# EAGLE design Sensor_Board_v2.4.1.2.N (EAGLE 9.4.0)

## Sheet 1 of 2
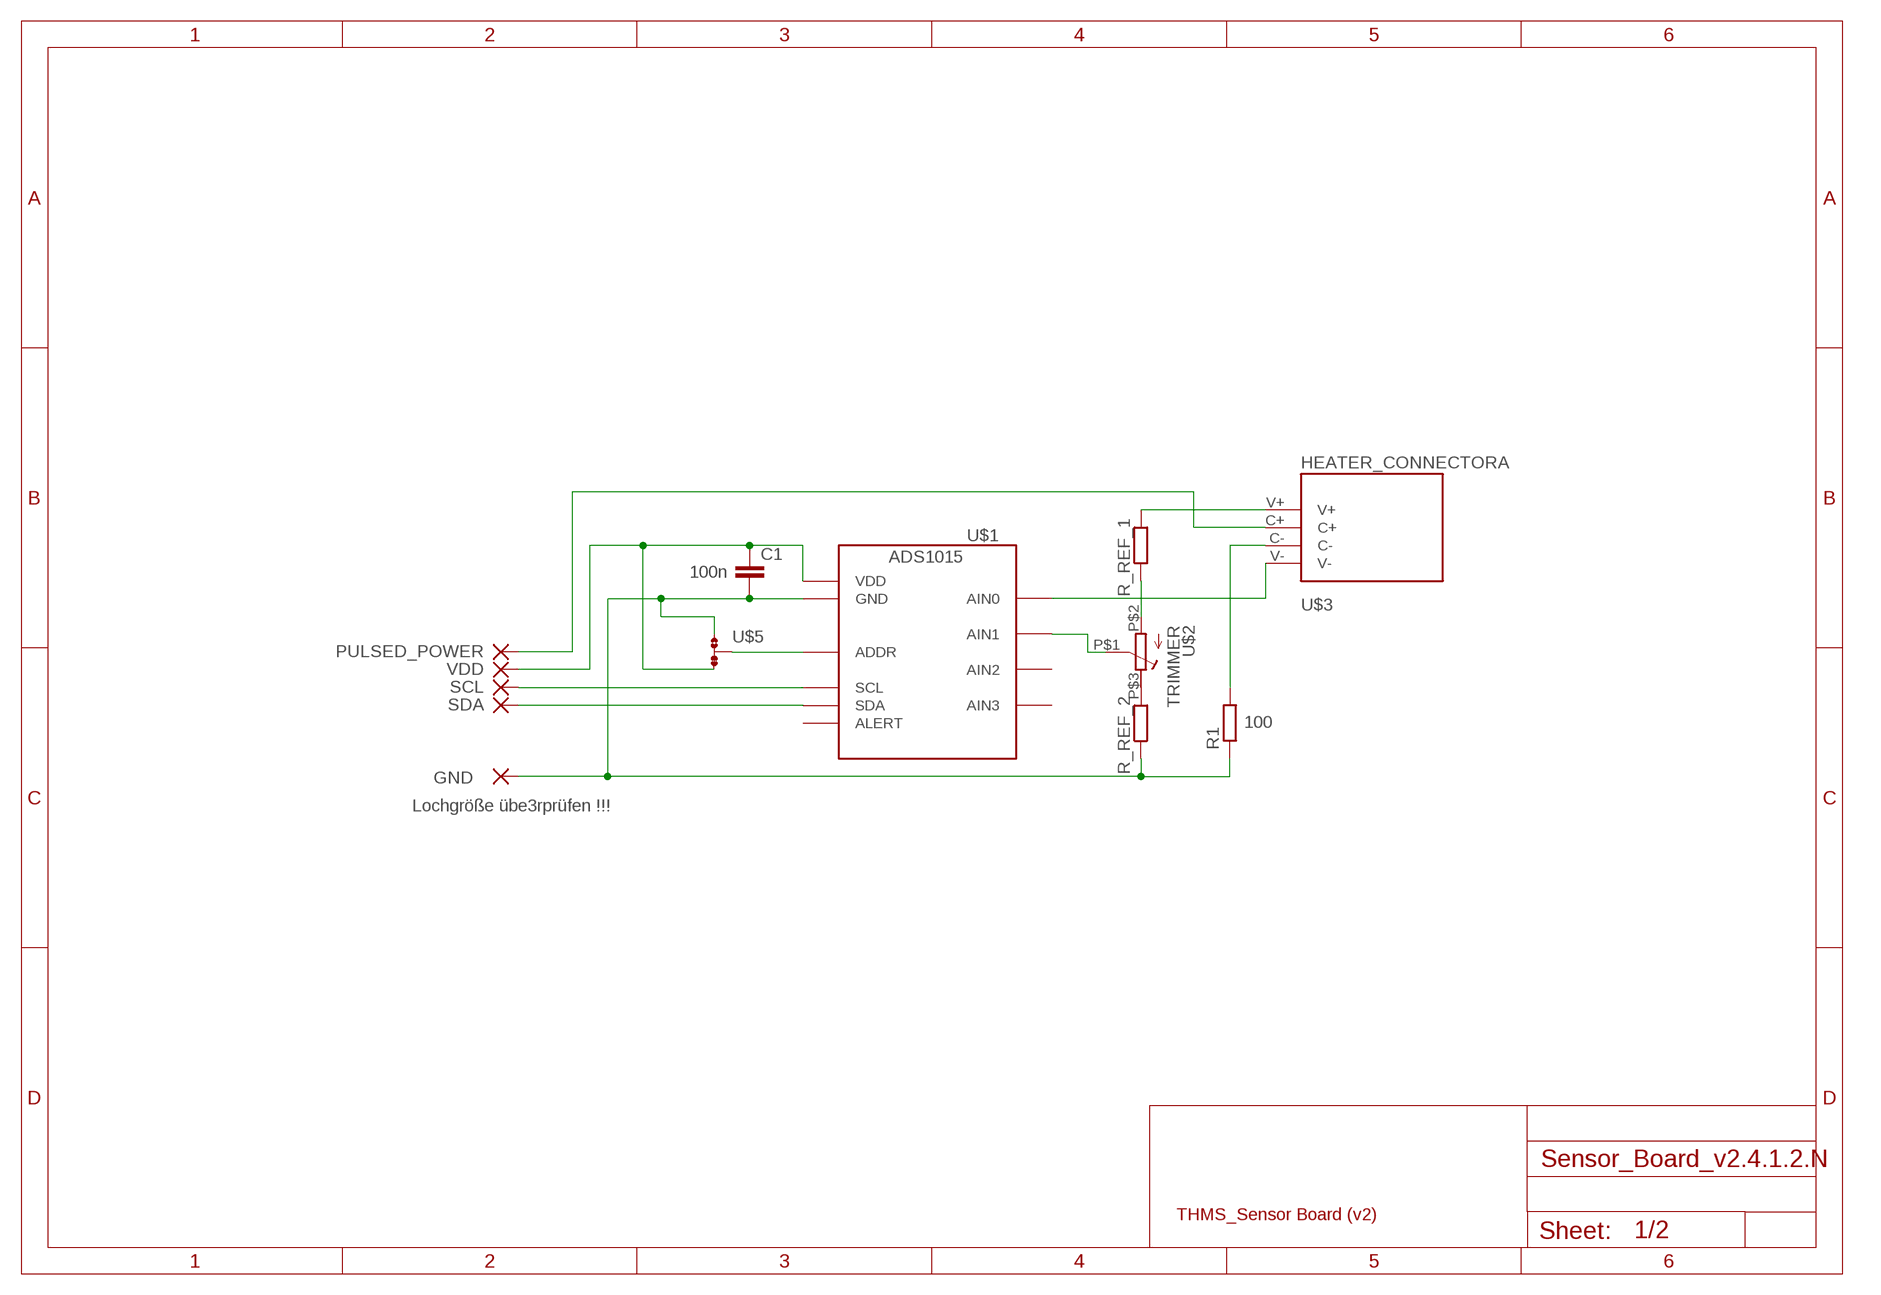
[diagram p0: schematic, sheet 1]

### Parts
C1  100n  C-EUC0201  [C0201]
GND  2,54/1,1  [2,54/1,1]
PULSED_POWER  SMD_PADSMD05-2(STPOO_DEFINED)  [SMD0,5-2(STOP_DEFINED)]
R1  100  R-EU_R0402  [R0402]
R_REF_1  0  R-EU_R0201  [R0201]
R_REF_2  0  R-EU_R0201  [R0201]
SCL  SMD_PADSMD05-2(STPOO_DEFINED)  [SMD0,5-2(STOP_DEFINED)]
SDA  SMD_PADSMD05-2(STPOO_DEFINED)  [SMD0,5-2(STOP_DEFINED)]
U$1  ADS1015  [X2QFN10]
U$2  TRIMMER  [2MM]
U$3  HEATER_CONNECTORA  [CONECTION_GATES]
U$5  0R-JUMP-1CON  [D0R-JMP(D)]
VDD  SMD_PADSMD05-2(STPOO_DEFINED)  [SMD0,5-2(STOP_DEFINED)]

### Nets
GND: C1.2 GND.1(P) R1.1 R_REF_2.1 U$1.P$3(GND) U$5.1 ; also sheet 2
N$1: R_REF_2.2 U$2.P$3(A)
N$2: SCL.1(P) U$1.P$10(SCL)
N$3: SDA.1(P) U$1.P$9(SDA)
N$4: R_REF_1.1 U$2.P$2(E)
N$5: R_REF_1.2 U$3.V+
N$6: R1.2 U$3.C-
N$7: PULSED_POWER.1(P) U$3.C+
N$8: U$1.P$4(AIN0) U$3.V-
N$9: U$1.P$1(ADDR) U$5.2
N$10: U$1.P$5(AIN1) U$2.P$1(S)
VDD: C1.1 U$1.P$8(VDD) U$5.3 VDD.1(P) ; also sheet 2
Unconnected: U$1.P$2(ALERT) U$1.P$6(AIN2) U$1.P$7(AIN3)

### Notes on the sheet
- Lochgröße übe3rprüfen !!!
- THMS_Sensor Board (v2)

## Sheet 2 of 2
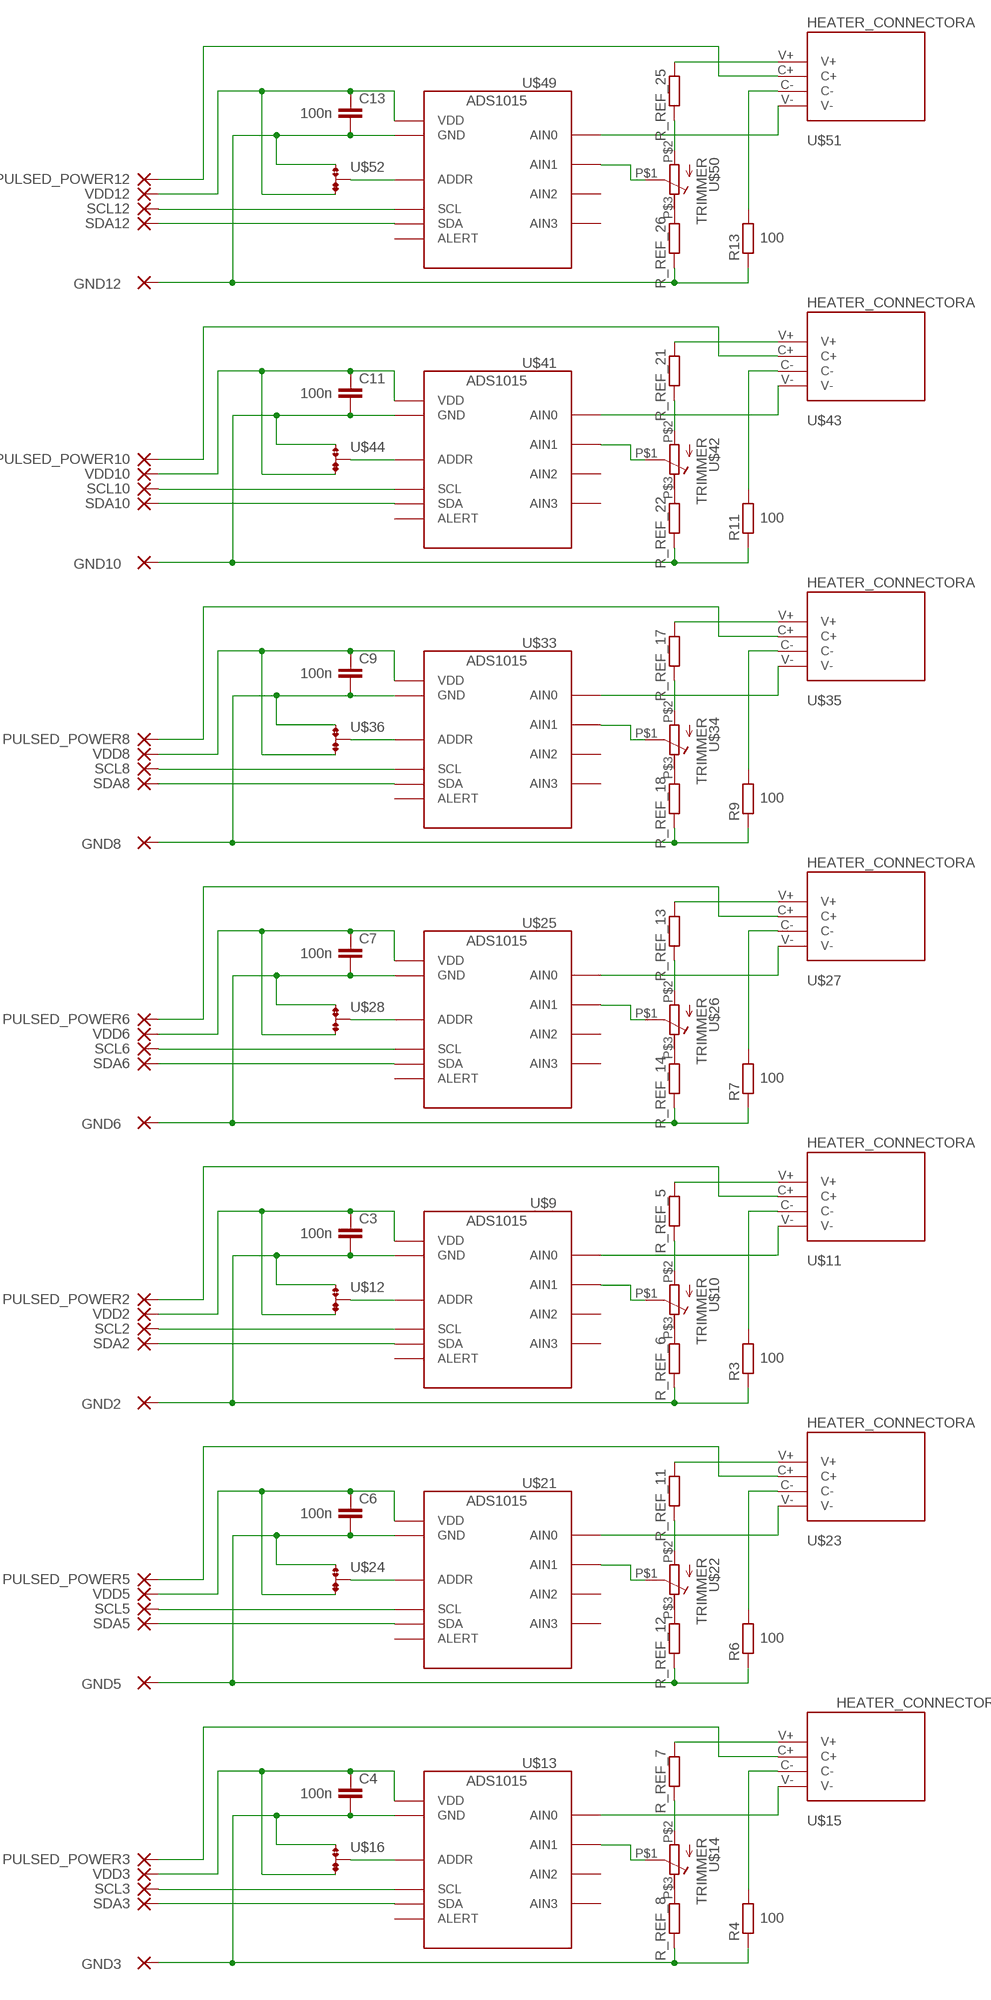
[diagram p1: schematic, sheet 2]

### Parts
C3  100n  C-EUC0201  [C0201]
C4  100n  C-EUC0201  [C0201]
C6  100n  C-EUC0201  [C0201]
C7  100n  C-EUC0201  [C0201]
C9  100n  C-EUC0201  [C0201]
C11  100n  C-EUC0201  [C0201]
C13  100n  C-EUC0201  [C0201]
GND2  2,54/1,1  [2,54/1,1]
GND3  2,54/1,1  [2,54/1,1]
GND5  2,54/1,1  [2,54/1,1]
GND6  2,54/1,1  [2,54/1,1]
GND8  2,54/1,1  [2,54/1,1]
GND10  2,54/1,1  [2,54/1,1]
GND12  2,54/1,1  [2,54/1,1]
PULSED_POWER2  SMD_PADSMD05-2(STPOO_DEFINED)  [SMD0,5-2(STOP_DEFINED)]
PULSED_POWER3  SMD_PADSMD05-2(STPOO_DEFINED)  [SMD0,5-2(STOP_DEFINED)]
PULSED_POWER5  SMD_PADSMD05-2(STPOO_DEFINED)  [SMD0,5-2(STOP_DEFINED)]
PULSED_POWER6  SMD_PADSMD05-2(STPOO_DEFINED)  [SMD0,5-2(STOP_DEFINED)]
PULSED_POWER8  SMD_PADSMD05-2(STPOO_DEFINED)  [SMD0,5-2(STOP_DEFINED)]
PULSED_POWER10  SMD_PADSMD05-2(STPOO_DEFINED)  [SMD0,5-2(STOP_DEFINED)]
PULSED_POWER12  SMD_PADSMD05-2(STPOO_DEFINED)  [SMD0,5-2(STOP_DEFINED)]
R3  100  R-EU_R0402  [R0402]
R4  100  R-EU_R0402  [R0402]
R6  100  R-EU_R0402  [R0402]
R7  100  R-EU_R0402  [R0402]
R9  100  R-EU_R0402  [R0402]
R11  100  R-EU_R0402  [R0402]
R13  100  R-EU_R0402  [R0402]
R_REF_5  0  R-EU_R0201  [R0201]
R_REF_6  0  R-EU_R0201  [R0201]
R_REF_7  0  R-EU_R0201  [R0201]
R_REF_8  0  R-EU_R0201  [R0201]
R_REF_11  0  R-EU_R0201  [R0201]
R_REF_12  0  R-EU_R0201  [R0201]
R_REF_13  0  R-EU_R0201  [R0201]
R_REF_14  0  R-EU_R0201  [R0201]
R_REF_17  0  R-EU_R0201  [R0201]
R_REF_18  0  R-EU_R0201  [R0201]
R_REF_21  0  R-EU_R0201  [R0201]
R_REF_22  0  R-EU_R0201  [R0201]
R_REF_25  0  R-EU_R0201  [R0201]
R_REF_26  0  R-EU_R0201  [R0201]
SCL2  SMD_PADSMD05-2(STPOO_DEFINED)  [SMD0,5-2(STOP_DEFINED)]
SCL3  SMD_PADSMD05-2(STPOO_DEFINED)  [SMD0,5-2(STOP_DEFINED)]
SCL5  SMD_PADSMD05-2(STPOO_DEFINED)  [SMD0,5-2(STOP_DEFINED)]
SCL6  SMD_PADSMD05-2(STPOO_DEFINED)  [SMD0,5-2(STOP_DEFINED)]
SCL8  SMD_PADSMD05-2(STPOO_DEFINED)  [SMD0,5-2(STOP_DEFINED)]
SCL10  SMD_PADSMD05-2(STPOO_DEFINED)  [SMD0,5-2(STOP_DEFINED)]
SCL12  SMD_PADSMD05-2(STPOO_DEFINED)  [SMD0,5-2(STOP_DEFINED)]
SDA2  SMD_PADSMD05-2(STPOO_DEFINED)  [SMD0,5-2(STOP_DEFINED)]
SDA3  SMD_PADSMD05-2(STPOO_DEFINED)  [SMD0,5-2(STOP_DEFINED)]
SDA5  SMD_PADSMD05-2(STPOO_DEFINED)  [SMD0,5-2(STOP_DEFINED)]
SDA6  SMD_PADSMD05-2(STPOO_DEFINED)  [SMD0,5-2(STOP_DEFINED)]
SDA8  SMD_PADSMD05-2(STPOO_DEFINED)  [SMD0,5-2(STOP_DEFINED)]
SDA10  SMD_PADSMD05-2(STPOO_DEFINED)  [SMD0,5-2(STOP_DEFINED)]
SDA12  SMD_PADSMD05-2(STPOO_DEFINED)  [SMD0,5-2(STOP_DEFINED)]
U$9  ADS1015  [X2QFN10]
U$10  TRIMMER  [2MM]
U$11  HEATER_CONNECTORA  [CONECTION_GATES]
U$12  0R-JUMP-1CON  [D0R-JMP(D)]
U$13  ADS1015  [X2QFN10]
U$14  TRIMMER  [2MM]
U$15  HEATER_CONNECTORA  [CONECTION_GATES]
U$16  0R-JUMP-1CON  [D0R-JMP(D)]
U$21  ADS1015  [X2QFN10]
U$22  TRIMMER  [2MM]
U$23  HEATER_CONNECTORA  [CONECTION_GATES]
U$24  0R-JUMP-1CON  [D0R-JMP(D)]
U$25  ADS1015  [X2QFN10]
U$26  TRIMMER  [2MM]
U$27  HEATER_CONNECTORA  [CONECTION_GATES]
U$28  0R-JUMP-1CON  [D0R-JMP(D)]
U$33  ADS1015  [X2QFN10]
U$34  TRIMMER  [2MM]
U$35  HEATER_CONNECTORA  [CONECTION_GATES]
U$36  0R-JUMP-1CON  [D0R-JMP(D)]
U$41  ADS1015  [X2QFN10]
U$42  TRIMMER  [2MM]
U$43  HEATER_CONNECTORA  [CONECTION_GATES]
U$44  0R-JUMP-1CON  [D0R-JMP(D)]
U$49  ADS1015  [X2QFN10]
U$50  TRIMMER  [2MM]
U$51  HEATER_CONNECTORA  [CONECTION_GATES]
U$52  0R-JUMP-1CON  [D0R-JMP(D)]
VDD2  SMD_PADSMD05-2(STPOO_DEFINED)  [SMD0,5-2(STOP_DEFINED)]
VDD3  SMD_PADSMD05-2(STPOO_DEFINED)  [SMD0,5-2(STOP_DEFINED)]
VDD5  SMD_PADSMD05-2(STPOO_DEFINED)  [SMD0,5-2(STOP_DEFINED)]
VDD6  SMD_PADSMD05-2(STPOO_DEFINED)  [SMD0,5-2(STOP_DEFINED)]
VDD8  SMD_PADSMD05-2(STPOO_DEFINED)  [SMD0,5-2(STOP_DEFINED)]
VDD10  SMD_PADSMD05-2(STPOO_DEFINED)  [SMD0,5-2(STOP_DEFINED)]
VDD12  SMD_PADSMD05-2(STPOO_DEFINED)  [SMD0,5-2(STOP_DEFINED)]

### Nets
GND: C3.2 C4.2 C6.2 C7.2 C9.2 C11.2 C13.2 GND2.1(P) GND3.1(P) GND5.1(P) GND6.1(P) GND8.1(P) GND10.1(P) GND12.1(P) R3.1 R4.1 R6.1 R7.1 R9.1 R11.1 R13.1 R_REF_6.1 R_REF_8.1 R_REF_12.1 R_REF_14.1 R_REF_18.1 R_REF_22.1 R_REF_26.1 U$9.P$3(GND) U$12.1 U$13.P$3(GND) U$16.1 U$21.P$3(GND) U$24.1 U$25.P$3(GND) U$28.1 U$33.P$3(GND) U$36.1 U$41.P$3(GND) U$44.1 U$49.P$3(GND) U$52.1 ; also sheet 1
N$21: SCL2.1(P) U$9.P$10(SCL)
N$22: SDA2.1(P) U$9.P$9(SDA)
N$23: R_REF_5.2 U$11.V+
N$24: R3.2 U$11.C-
N$25: U$9.P$4(AIN0) U$11.V-
N$26: PULSED_POWER2.1(P) U$11.C+
N$27: U$9.P$5(AIN1) U$10.P$1(S)
N$28: U$9.P$1(ADDR) U$12.2
N$29: R_REF_6.2 U$10.P$3(A)
N$30: R_REF_5.1 U$10.P$2(E)
N$31: SCL3.1(P) U$13.P$10(SCL)
N$32: SDA3.1(P) U$13.P$9(SDA)
N$33: R_REF_7.2 U$15.V+
N$34: R4.2 U$15.C-
N$35: U$13.P$4(AIN0) U$15.V-
N$36: PULSED_POWER3.1(P) U$15.C+
N$37: U$13.P$5(AIN1) U$14.P$1(S)
N$38: U$13.P$1(ADDR) U$16.2
N$39: R_REF_8.2 U$14.P$3(A)
N$40: R_REF_7.1 U$14.P$2(E)
N$51: SCL5.1(P) U$21.P$10(SCL)
N$52: SDA5.1(P) U$21.P$9(SDA)
N$53: R_REF_11.2 U$23.V+
N$54: R6.2 U$23.C-
N$55: U$21.P$4(AIN0) U$23.V-
N$56: PULSED_POWER5.1(P) U$23.C+
N$57: U$21.P$5(AIN1) U$22.P$1(S)
N$58: U$21.P$1(ADDR) U$24.2
N$59: R_REF_12.2 U$22.P$3(A)
N$60: R_REF_11.1 U$22.P$2(E)
N$61: SCL6.1(P) U$25.P$10(SCL)
N$62: SDA6.1(P) U$25.P$9(SDA)
N$63: R_REF_13.2 U$27.V+
N$64: R7.2 U$27.C-
N$65: U$25.P$4(AIN0) U$27.V-
N$66: PULSED_POWER6.1(P) U$27.C+
N$67: U$25.P$5(AIN1) U$26.P$1(S)
N$68: U$25.P$1(ADDR) U$28.2
N$69: R_REF_14.2 U$26.P$3(A)
N$70: R_REF_13.1 U$26.P$2(E)
N$81: SCL8.1(P) U$33.P$10(SCL)
N$82: SDA8.1(P) U$33.P$9(SDA)
N$83: R_REF_17.2 U$35.V+
N$84: R9.2 U$35.C-
N$85: U$33.P$4(AIN0) U$35.V-
N$86: PULSED_POWER8.1(P) U$35.C+
N$87: U$33.P$5(AIN1) U$34.P$1(S)
N$88: U$33.P$1(ADDR) U$36.2
N$89: R_REF_18.2 U$34.P$3(A)
N$90: R_REF_17.1 U$34.P$2(E)
N$101: SCL10.1(P) U$41.P$10(SCL)
N$102: SDA10.1(P) U$41.P$9(SDA)
N$103: R_REF_21.2 U$43.V+
N$104: R11.2 U$43.C-
N$105: U$41.P$4(AIN0) U$43.V-
N$106: PULSED_POWER10.1(P) U$43.C+
N$107: U$41.P$5(AIN1) U$42.P$1(S)
N$108: U$41.P$1(ADDR) U$44.2
N$109: R_REF_22.2 U$42.P$3(A)
N$110: R_REF_21.1 U$42.P$2(E)
N$121: SCL12.1(P) U$49.P$10(SCL)
N$122: SDA12.1(P) U$49.P$9(SDA)
N$123: R_REF_25.2 U$51.V+
N$124: R13.2 U$51.C-
N$125: U$49.P$4(AIN0) U$51.V-
N$126: PULSED_POWER12.1(P) U$51.C+
N$127: U$49.P$5(AIN1) U$50.P$1(S)
N$128: U$49.P$1(ADDR) U$52.2
N$129: R_REF_26.2 U$50.P$3(A)
N$130: R_REF_25.1 U$50.P$2(E)
VDD: C3.1 C4.1 C6.1 C7.1 C9.1 C11.1 C13.1 U$9.P$8(VDD) U$12.3 U$13.P$8(VDD) U$16.3 U$21.P$8(VDD) U$24.3 U$25.P$8(VDD) U$28.3 U$33.P$8(VDD) U$36.3 U$41.P$8(VDD) U$44.3 U$49.P$8(VDD) U$52.3 VDD2.1(P) VDD3.1(P) VDD5.1(P) VDD6.1(P) VDD8.1(P) VDD10.1(P) VDD12.1(P) ; also sheet 1
Unconnected: U$9.P$2(ALERT) U$9.P$6(AIN2) U$9.P$7(AIN3) U$13.P$2(ALERT) U$13.P$6(AIN2) U$13.P$7(AIN3) U$21.P$2(ALERT) U$21.P$6(AIN2) U$21.P$7(AIN3) U$25.P$2(ALERT) U$25.P$6(AIN2) U$25.P$7(AIN3) U$33.P$2(ALERT) U$33.P$6(AIN2) U$33.P$7(AIN3) U$41.P$2(ALERT) U$41.P$6(AIN2) U$41.P$7(AIN3) U$49.P$2(ALERT) U$49.P$6(AIN2) U$49.P$7(AIN3)

## Library data of the parts
C1 C3 C4 C6 C7 C9 C11 C13 = rcl:C-EU: CAPACITOR, European symbol; SPICEPREFIX: C
GND GND2 GND3 GND5 GND6 GND8 GND10 GND12 = wirepad:2,54/1,1: THROUGH-HOLE PAD
PULSED_POWER PULSED_POWER2 PULSED_POWER3 PULSED_POWER5 PULSED_POWER6 PULSED_POWER8 PULSED_POWER10 PULSED_POWER12 SCL SCL2 SCL3 SCL5 SCL6 SCL8 SCL10 SCL12 SDA SDA2 SDA3 SDA5 SDA6 SDA8 SDA10 SDA12 VDD VDD2 VDD3 VDD5 VDD6 VDD8 VDD10 VDD12 = WIREPAD0:SMD_PAD
R1 R3 R4 R6 R7 R9 R11 R13 R_REF_1 R_REF_2 R_REF_5-R_REF_8 R_REF_11-R_REF_14 R_REF_17 R_REF_18 R_REF_21 R_REF_22 R_REF_25 R_REF_26 = rcl:R-EU_: RESISTOR, European symbol; SPICEPREFIX: R
U$1 U$9 U$13 U$21 U$25 U$33 U$41 U$49 = bt_adc:ADS1015: Ti ADS1015 12-bit ADC Ultra-Small, Low-Power, 12-Bit Analog-to-Digital Converter with Internal Reference The ADS1013, ADS1014, and ADS1015 are precision analog-to-digital converters (ADCs) with 12 bits of resolution offered in an ultra-small, leadless QFN-10 package or an MSOP-10 package. \ Source: http://focus.ti.com/docs/prod/folders/print/ads1015.html
U$2 U$10 U$14 U$22 U$26 U$34 U$42 U$50 = Poti:TRIMMER
U$3 U$11 U$15 U$23 U$27 U$35 U$43 U$51 = HeaterConnector:HEATER_CONNECTOR
U$5 U$12 U$16 U$24 U$28 U$36 U$44 U$52 = jump-0r-smd_own:0R-JUMP-1CON

## Board
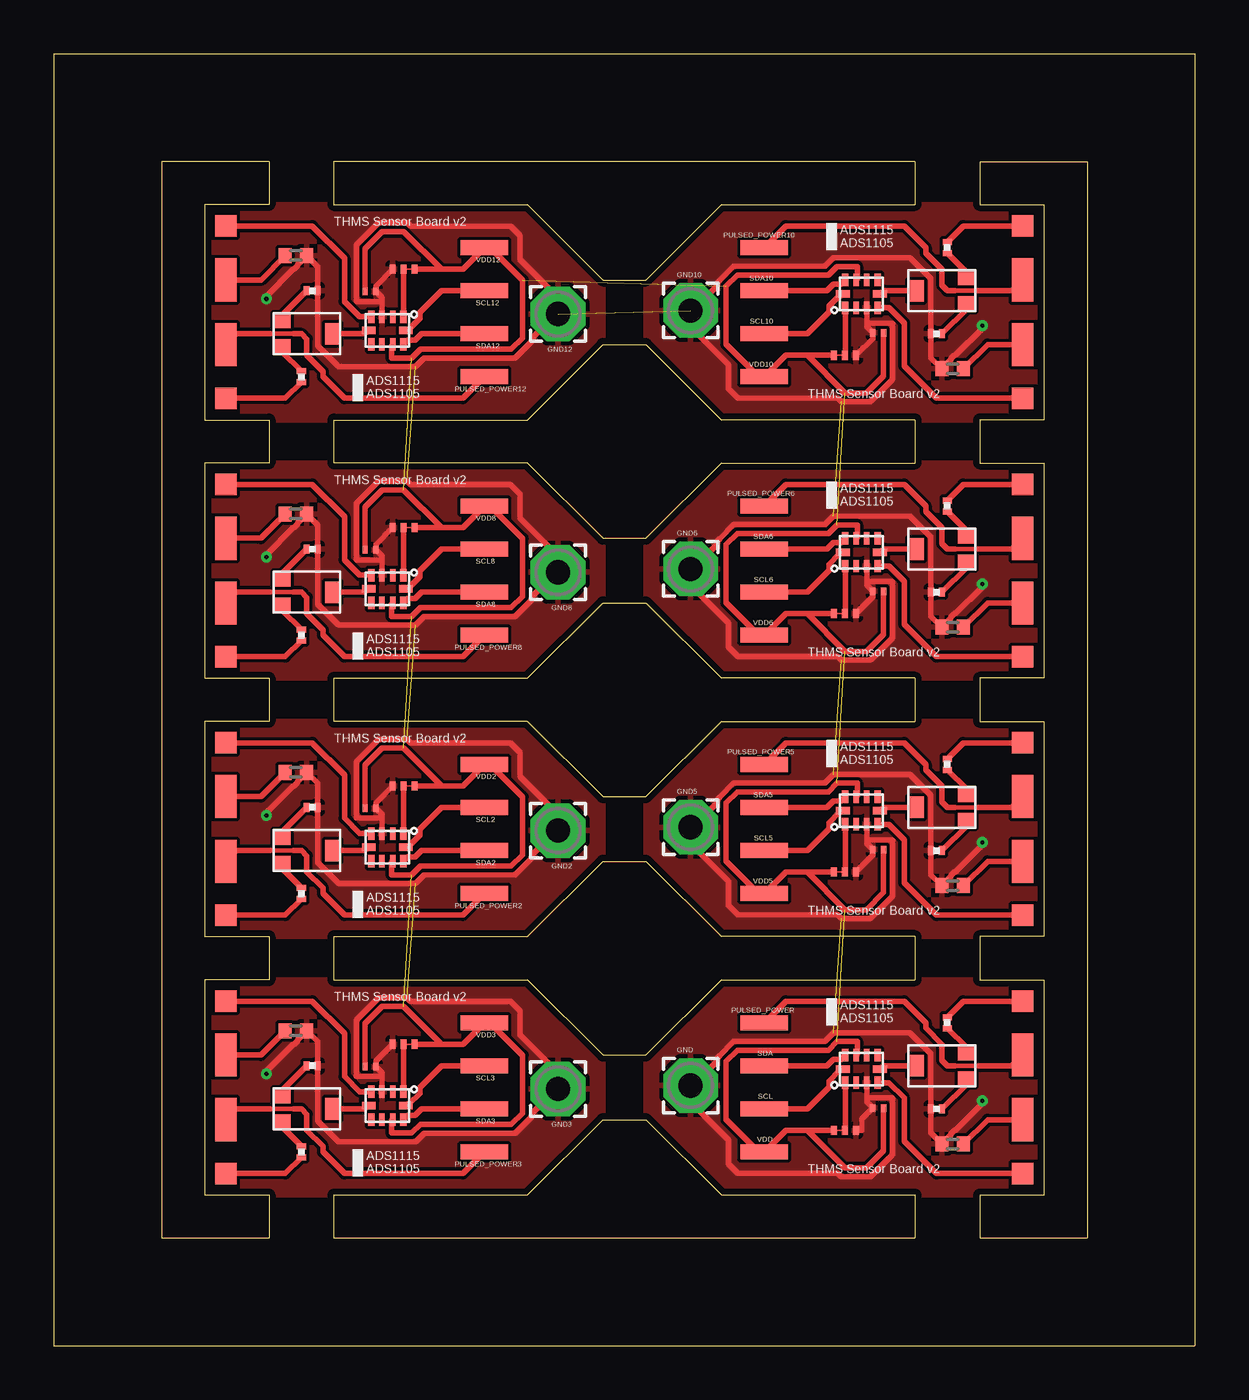
[diagram p2: board, top side]
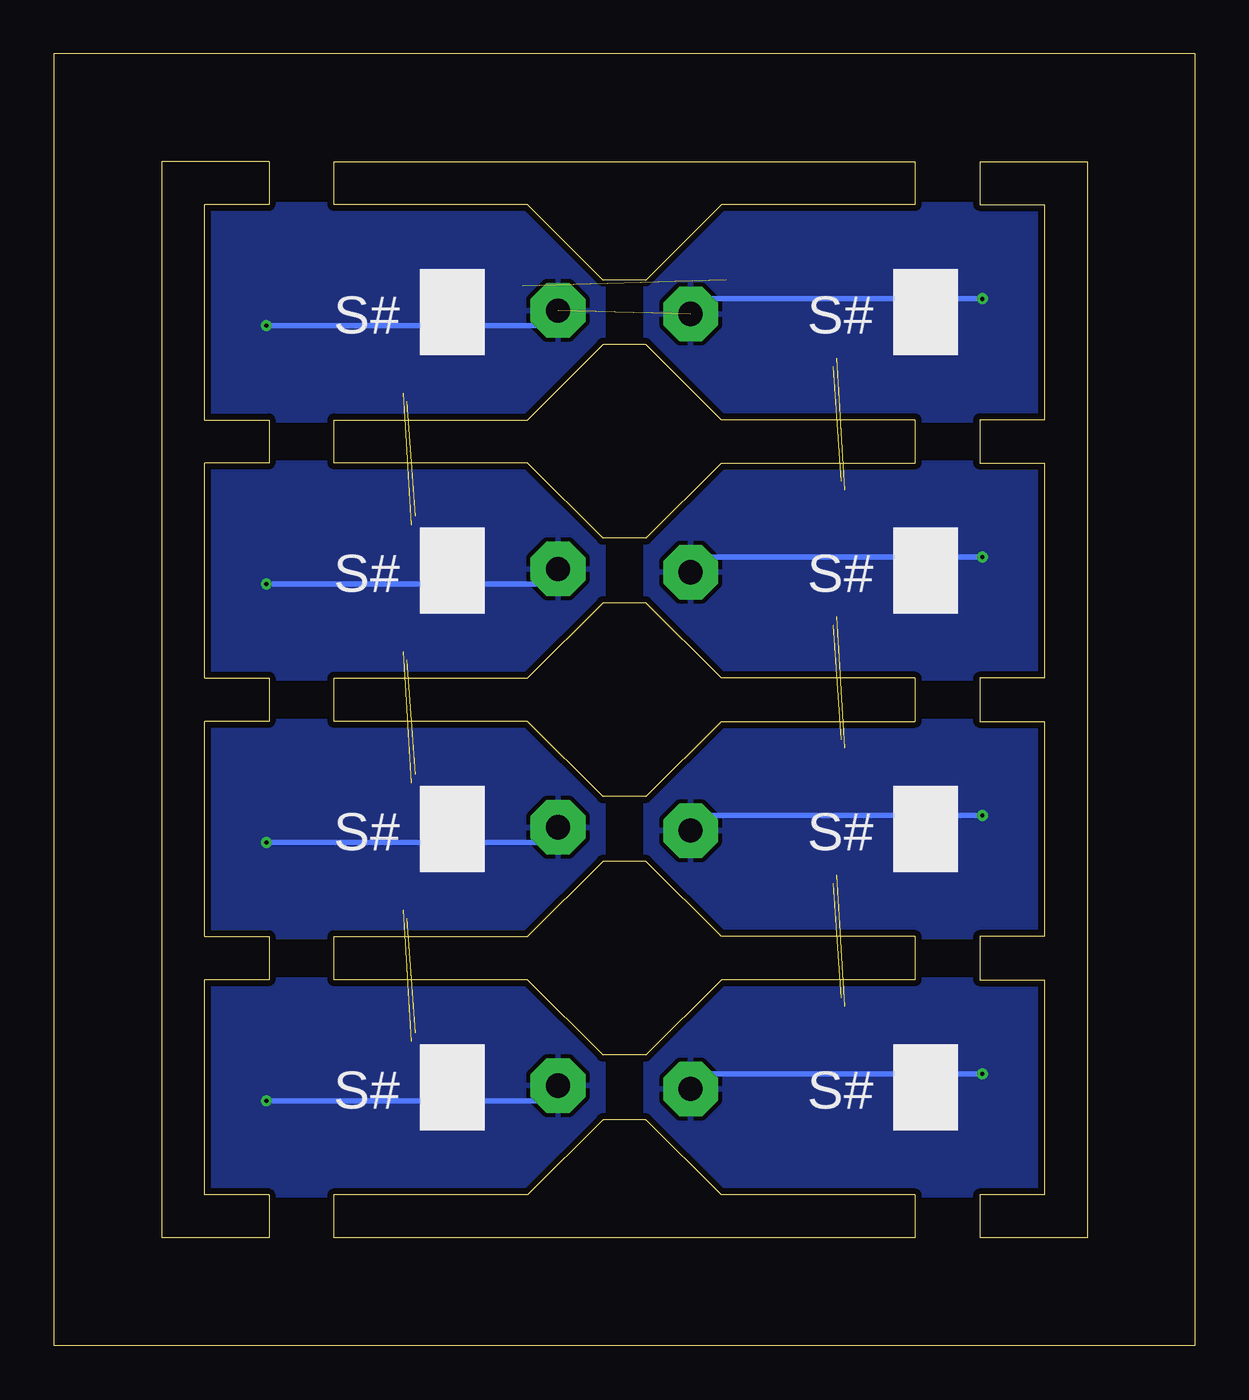
[diagram p3: board, bottom side, seen from below]

Size 53 x 60 mm. Coordinates in mm from the lower left corner, seen from the top.
Outline: 27.5,34.5 31,31 40,31 40,29 31,29 27.5,25.5 25.5,25.5 22,29 13,29 13,31 22,31 25.5,34.5 27.5,34.5
Outline: 46,31 46,41 43,41 43,43 46,43 46,53 43,53 43,55 48,55 48,5 43,5 43,7 46,7 46,17 43,17 43,19 46,19 46,29 43,29 43,31 46,31
Outline: 31,41 27.5,37.5 25.5,37.5 22,41 13,41 13,43 22,43 25.5,46.5 27.5,46.5 31,43 40,43 40,41 31,41
Outline: 7,41 7,31 10,31 10,29 7,29 7,19 10,19 10,17 7,17 7,7 10,7 10,5 5,5 5,55 10,55 10,53 7,53 7,43 10,43 10,41 7,41
Outline: 0,60 0,0 53,0 53,60 0,60
Outline: 13,5 40,5 40,7 31,7 27.5,10.5 25.5,10.5 22,7 13,7 13,5
Outline: 22,19 25.5,22.5 27.5,22.5 31,19 40,19 40,17 31,17 27.5,13.5 25.5,13.5 22,17 13,17 13,19 22,19
Outline: 25.5,49.5 22,53 13,53 13,55 40,55 40,53 31,53 27.5,49.5 25.5,49.5
Copper layers (1*16): Top 0.035mm / dielectric 1.5mm / Bottom 0.035mm
Design rules "PCB-POOL Standard *": minimum track width 0.15mm, minimum drill 0.2mm, track to track 0.15mm, track to pad 0.15mm, pad to pad 0.15mm, via to via 0.15mm, smd to smd 0.15mm, copper to edge 0.3mm, drill to drill 0.2mm, minimum pad ring 0.2mm, minimum via ring 0.15mm, stop-mask expansion 0.075mm, vias tented up to drill 0.5mm, thermal gap 0.2mm

### Footprints (pad centres in the part's own frame; a part is rotated, then mirrored left to right if it is on the bottom)
C0201 = smd 0.25 x 0.35: 1 -0.25,0; 2 0.25,0
2,54/1,1 = drill 1.118 pad 2.54 octagon: 1 0,0
SMD0,5-2(STOP_DEFINED) = smd 0.7 x 2.2: 1 0,0
R0402 = smd 0.6 x 0.7: 1 -0.5,0; 2 0.5,0
R0201 = smd 0.28 x 0.43: 1 -0.255,0; 2 0.255,0
X2QFN10 = smd 0.3 x 0.58: P$1 -0.75,-0.64; P$4 0.75,-0.64; P$6 0.75,0.64; P$9 -0.75,0.64 | smd 0.25 x 0.58: P$2 -0.25,-0.64; P$3 0.25,-0.64; P$7 0.25,0.64; P$8 -0.25,0.64 | smd 0.63 x 0.35: P$5 0.86,0; P$10 -0.86,0
2MM = smd 1 x 0.7: P$1 0,0.95 | smd 0.7 x 0.8: P$2 0.6,-1.4; P$3 -0.6,-1.4
CONECTION_GATES = smd 2 x 1: C+ 1.5,0; C- -1.5,0 | smd 1 x 1: V+ 4,0; V- -4,0
D0R-JMP(D) = smd 0.43 x 0.28: 1 0,0.507; 2 0,0.001; 3 0,-0.509

### Placement (x,y rotation side)
C1  38.29,11.04 180 top
C3  14.71,24.96 0 top
C4  14.71,12.96 0 top
C6  38.29,23.04 180 top
C7  38.29,35.04 180 top
C9  14.71,36.96 0 top
C11  38.29,47.04 180 top
C13  14.71,48.96 0 top
GND  29.58,12.08 0 top
GND2  23.42,23.92 180 top
GND3  23.42,11.92 180 top
GND5  29.58,24.08 0 top
GND6  29.58,36.08 0 top
GND8  23.42,35.92 180 top
GND10  29.58,48.08 0 top
GND12  23.42,47.92 180 top
PULSED_POWER  33,15 90 top
PULSED_POWER2  20,21 270 top
PULSED_POWER3  20,9 270 top
PULSED_POWER5  33,27 90 top
PULSED_POWER6  33,39 90 top
PULSED_POWER8  20,33 270 top
PULSED_POWER10  33,51 90 top
PULSED_POWER12  20,45 270 top
R1  41.75,9.37 0 top
R3  11.25,26.63 180 top
R4  11.25,14.63 180 top
R6  41.75,21.37 0 top
R7  41.75,33.37 0 top
R9  11.25,38.63 180 top
R11  41.75,45.37 0 top
R13  11.25,50.63 180 top
R_REF_1  41.5,15 90 top
R_REF_2  41,11 0 top
R_REF_5  11.5,21 270 top
R_REF_6  12,25 180 top
R_REF_7  11.5,9 270 top
R_REF_8  12,13 180 top
R_REF_11  41.5,27 90 top
R_REF_12  41,23 0 top
R_REF_13  41.5,39 90 top
R_REF_14  41,35 0 top
R_REF_17  11.5,33 270 top
R_REF_18  12,37 180 top
R_REF_21  41.5,51 90 top
R_REF_22  41,47 0 top
R_REF_25  11.5,45 270 top
R_REF_26  12,49 180 top
SCL  33,11 90 top
SCL2  20,25 270 top
SCL3  20,13 270 top
SCL5  33,23 90 top
SCL6  33,35 90 top
SCL8  20,37 270 top
SCL10  33,47 90 top
SCL12  20,49 270 top
SDA  33,13 90 top
SDA2  20,23 270 top
SDA3  20,11 270 top
SDA5  33,25 90 top
SDA6  33,37 90 top
SDA8  20,35 270 top
SDA10  33,49 90 top
SDA12  20,47 270 top
U$1  37.51,12.85 0 top
U$2  41,13 90 top
U$3  45,12 90 top
U$5  36.75,10 270 top
U$9  15.49,23.15 180 top
U$10  12,23 270 top
U$11  8,24 270 top
U$12  16.25,26 90 top
U$13  15.49,11.15 180 top
U$14  12,11 270 top
U$15  8,12 270 top
U$16  16.25,14 90 top
U$21  37.51,24.85 0 top
U$22  41,25 90 top
U$23  45,24 90 top
U$24  36.75,22 270 top
U$25  37.51,36.85 0 top
U$26  41,37 90 top
U$27  45,36 90 top
U$28  36.75,34 270 top
U$33  15.49,35.15 180 top
U$34  12,35 270 top
U$35  8,36 270 top
U$36  16.25,38 90 top
U$41  37.51,48.85 0 top
U$42  41,49 90 top
U$43  45,48 90 top
U$44  36.75,46 270 top
U$49  15.49,47.15 180 top
U$50  12,47 270 top
U$51  8,48 270 top
U$52  16.25,50 90 top
VDD  33,9 90 top
VDD2  20,27 270 top
VDD3  20,15 270 top
VDD5  33,21 90 top
VDD6  33,33 90 top
VDD8  20,39 270 top
VDD10  33,45 90 top
VDD12  20,51 270 top

### Tracks (layer width: path | path; a pad name or v marks a point on that pad's centre or on a via)
GND  (via drill 0.2)  (7 unrouted)
  Top 0.254: 37.76,11.5 37.76,11.32 C1.2 37.54,10.54 37.54,10 U$5.1 | 37.76,11.5 U$1.P$3 | v43.12,11.38 43.12,11.24 41.88,10 41.83,10 41.67,9.84 41.67,9.79 R1.1 40.74,9.88 R_REF_2.1 40.74,13.55 39.76,14.53 36.21,14.53 35.81,14.13 31.57,14.13 30.94,13.49 30.82,13.38 30.82,13.37 30.82,13.24 29.58,12 | 37.76,11.5 38.93,11.5 38.96,11.46 38.94,11.44 38.94,8.87 37.92,7.85 36.58,7.85 36.43,8 31.78,8 31.34,8.44 31.34,9.57 29.58,11.33 29.58,12 | 29.58,12 GND.1 | 15.24,12.5 15.24,12.68 C4.2 14.96,13.22 U$16.1 | 15.24,12.5 U$13.P$3 | v9.88,12.62 9.88,12.76 11.12,14 11.17,14 11.33,14.16 11.33,14.21 R4.1 12.26,14.12 R_REF_8.1 12.26,10.45 13.24,9.47 16.79,9.47 17.19,9.87 21.43,9.87 22.06,10.51 22.18,10.62 22.18,10.63 22.18,10.76 23.42,12 | 15.24,12.5 14.07,12.5 14.04,12.54 14.06,12.56 14.06,15.13 15.08,16.15 16.42,16.15 16.57,16 21.22,16 21.66,15.56 21.66,14.43 23.42,12.67 23.42,12 | 23.42,12 GND3.1 | 37.76,23.5 37.76,23.32 C6.2 38.04,22.78 U$24.1 | 37.76,23.5 U$21.P$3 | v43.12,23.38 43.12,23.25 41.88,22 41.83,22 41.67,21.84 41.67,21.79 R6.1 40.74,21.88 R_REF_12.1 40.74,25.55 39.76,26.53 36.21,26.53 35.81,26.13 31.57,26.13 30.94,25.49 30.82,25.38 30.82,25.37 30.82,25.24 29.58,24 | 37.76,23.5 38.93,23.5 38.96,23.46 38.94,23.44 38.94,20.87 37.92,19.85 36.58,19.85 36.43,20 31.78,20 31.34,20.44 31.34,21.57 29.58,23.33 29.58,24 | 29.58,24 GND5.1 | 15.24,24.5 15.24,24.68 C3.2 14.96,25.22 U$12.1 | 15.24,24.5 U$9.P$3 | v9.88,24.62 9.88,24.75 11.12,26 11.17,26 11.33,26.16 11.33,26.21 R3.1 12.26,26.12 R_REF_6.1 12.26,22.45 13.24,21.47 16.79,21.47 17.19,21.87 21.43,21.87 22.06,22.51 22.18,22.62 22.18,22.63 22.18,22.76 23.42,24
  Top 0.254: 15.24,24.5 14.07,24.5 14.04,24.54 14.06,24.56 14.06,27.13 15.08,28.15 16.42,28.15 16.57,28 21.22,28 21.66,27.56 21.66,26.43 23.42,24.67 23.42,24 | 23.42,24 GND2.1 | 37.76,35.5 37.76,35.32 C7.2 38.04,34.78 U$28.1 | 37.76,35.5 U$25.P$3 | v43.12,35.38 43.12,35.24 41.88,34 41.83,34 41.67,33.84 41.67,33.79 R7.1 40.74,33.88 R_REF_14.1 40.74,37.55 39.76,38.53 36.21,38.53 35.81,38.13 31.57,38.13 30.94,37.49 30.82,37.38 30.82,37.37 30.82,37.24 29.58,36 | 37.76,35.5 38.93,35.5 38.96,35.46 38.94,35.44 38.94,32.87 37.92,31.85 36.58,31.85 36.43,32 31.78,32 31.34,32.44 31.34,33.57 29.58,35.33 29.58,36 | 29.58,36 GND6.1 | 15.24,36.5 15.24,36.68 C9.2 14.96,37.22 U$36.1 | 15.24,36.5 U$33.P$3 | v9.88,36.62 9.88,36.76 11.12,38 11.17,38 11.33,38.16 11.33,38.21 R9.1 12.26,38.12 R_REF_18.1 12.26,34.45 13.24,33.47 16.79,33.47 17.19,33.87 21.43,33.87 22.06,34.51 22.18,34.62 22.18,34.63 22.18,34.76 23.42,36 | 15.24,36.5 14.07,36.5 14.04,36.54 14.06,36.56 14.06,39.13 15.08,40.15 16.42,40.15 16.57,40 21.22,40 21.66,39.56 21.66,38.43 23.42,36.67 23.42,36 | 23.42,36 GND8.1 | 37.76,47.5 37.76,47.32 C11.2 38.04,46.78 U$44.1 | 37.76,47.5 U$41.P$3 | v43.12,47.38 43.12,47.24 41.88,46 41.83,46 41.67,45.84 41.67,45.79 R11.1 40.74,45.88 R_REF_22.1 40.74,49.55 39.76,50.53 36.21,50.53 35.81,50.13 31.57,50.13 30.94,49.49 30.82,49.38 30.82,49.37 30.82,49.24 29.58,48 | 37.76,47.5 38.93,47.5 38.96,47.46 38.94,47.44 38.94,44.87 37.92,43.85 36.58,43.85 36.43,44 31.78,44 31.34,44.44 31.34,45.57 29.58,47.33 29.58,48 | 29.58,48 GND10.1 | 15.24,48.5 15.24,48.68 C13.2 14.96,49.22 U$52.1
  Top 0.254: 15.24,48.5 U$49.P$3 | v9.88,48.62 9.88,48.76 11.12,50 11.17,50 11.33,50.16 11.33,50.21 R13.1 12.26,50.12 R_REF_26.1 12.26,46.45 13.24,45.47 16.79,45.47 17.19,45.87 21.43,45.87 22.06,46.51 22.18,46.62 22.18,46.63 22.18,46.76 23.42,48 | 15.24,48.5 14.07,48.5 14.04,48.54 14.06,48.56 14.06,51.13 15.08,52.15 16.42,52.15 16.57,52 21.22,52 21.66,51.56 21.66,50.43 23.42,48.67 23.42,48 | 23.42,48 GND12.1
  Bottom 0.254: v43.12,11.38 30.29,11.38 GND.1 | v9.88,12.62 22.71,12.62 GND3.1 | v43.12,23.38 30.29,23.38 GND5.1 | v9.88,24.62 22.71,24.62 GND2.1 | v43.12,35.38 30.29,35.38 GND6.1 | v9.88,36.62 22.71,36.62 GND8.1 | v43.12,47.38 30.29,47.38 GND10.1 | v9.88,48.62 22.71,48.62 GND12.1
  pour Top: 25.5,10.5 22,7 7,7 7,17 22,17 25.5,13.5
  pour Top: 27.5,13.5 31,17 46,17 46,7 31,7 27.5,10.5
  pour Bottom: 25.5,10.5 22,7 7,7 7,17 22,17 25.5,13.5
  pour Bottom: 27.5,13.5 31,17 46,17 46,7 31,7 27.5,10.5
  pour Top: 25.5,22.5 22,19 7,19 7,29 22,29 25.5,25.5
  pour Top: 27.5,25.5 31,29 46,29 46,19 31,19 27.5,22.5
  pour Bottom: 25.5,22.5 22,19 7,19 7,29 22,29 25.5,25.5
  pour Bottom: 27.5,25.5 31,29 46,29 46,19 31,19 27.5,22.5
  pour Top: 25.5,34.5 22,31 7,31 7,41 22,41 25.5,37.5
  pour Top: 27.5,37.5 31,41 46,41 46,31 31,31 27.5,34.5
  pour Bottom: 25.5,34.5 22,31 7,31 7,41 22,41 25.5,37.5
  pour Bottom: 27.5,37.5 31,41 46,41 46,31 31,31 27.5,34.5
  pour Top: 25.5,46.5 22,43 7,43 7,53 22,53 25.5,49.5
  pour Top: 27.5,49.5 31,53 46,53 46,43 31,43 27.5,46.5
  pour Bottom: 25.5,46.5 22,43 7,43 7,53 22,53 25.5,49.5
  pour Bottom: 27.5,49.5 31,53 46,53 46,43 31,43 27.5,46.5
N$1
  Top 0.254: U$2.P$3 42.4,12.14 R_REF_2.2
N$2
  Top 0.254: SCL.1 35,11 36,12 36,12.29 36.49,12.78 36.58,12.78 U$1.P$10
N$3
  Top 0.254: U$1.P$9 36.57,13.3 36.22,13.3 35.91,13 SDA.1
N$4
  Top 0.254: U$2.P$2 42.4,13.85 R_REF_1.1
N$5
  Top 0.254: R_REF_1.2 42.24,16 U$3.V+
N$6
  Top 0.254: R1.2 43.38,10.5 U$3.C-
N$7
  Top 0.2: 41.86,13 42.94,13
  Top 0.254: PULSED_POWER.1 34,16 39.5,16 40.5,15 40.5,14.75 41.25,14 41.25,13.25 41.5,13 41.86,13 | U$3.C+ 44.5,13 42.94,13
N$8
  Top 0.254: U$3.V- 41,8 39.5,9.5 39.5,11.5 38.79,12.21 U$1.P$4
N$9
  Top 0.254: U$5.2 U$1.P$1
N$10
  Top 0.254: U$1.P$5 38.44,12.92 38.53,12.92 38.6,13 U$2.P$1
N$21
  Top 0.254: SCL2.1 18,25 17,24 17,23.71 16.51,23.22 16.42,23.22 U$9.P$10
N$22
  Top 0.254: U$9.P$9 16.43,22.7 16.78,22.7 17.09,23 SDA2.1
N$23
  Top 0.254: R_REF_5.2 10.76,20 U$11.V+
N$24
  Top 0.254: R3.2 9.62,25.5 U$11.C-
N$25
  Top 0.254: U$11.V- 12,28 13.5,26.5 13.5,24.5 14.21,23.79 U$9.P$4
N$26
  Top 0.2: 11.14,23 10.06,23
  Top 0.254: PULSED_POWER2.1 19,20 13.5,20 12.5,21 12.5,21.25 11.75,22 11.75,22.75 11.5,23 11.14,23 | U$11.C+ 8.5,23 10.06,23
N$27
  Top 0.254: U$9.P$5 14.56,23.08 14.47,23.08 14.39,23 U$10.P$1
N$28
  Top 0.254: U$12.2 U$9.P$1
N$29
  Top 0.254: U$10.P$3 10.6,23.86 R_REF_6.2
N$30
  Top 0.254: U$10.P$2 10.6,22.16 R_REF_5.1
N$31
  Top 0.254: SCL3.1 18,13 17,12 17,11.71 16.51,11.22 16.42,11.22 U$13.P$10
N$32
  Top 0.254: U$13.P$9 16.43,10.7 16.78,10.7 17.09,11 SDA3.1
N$33
  Top 0.254: R_REF_7.2 10.76,8 U$15.V+
N$34
  Top 0.254: R4.2 9.62,13.5 U$15.C-
N$35
  Top 0.254: U$15.V- 12,16 13.5,14.5 13.5,12.5 14.21,11.79 U$13.P$4
N$36
  Top 0.2: 11.14,11 10.06,11
  Top 0.254: PULSED_POWER3.1 19,8 13.5,8 12.5,9 12.5,9.25 11.75,10 11.75,10.75 11.5,11 11.14,11 | U$15.C+ 8.5,11 10.06,11
N$37
  Top 0.254: U$13.P$5 14.56,11.08 14.47,11.08 14.39,11 U$14.P$1
N$38
  Top 0.254: U$16.2 U$13.P$1
N$39
  Top 0.254: U$14.P$3 10.6,11.86 R_REF_8.2
N$40
  Top 0.254: U$14.P$2 10.6,10.15 R_REF_7.1
N$51
  Top 0.254: SCL5.1 35,23 36,24 36,24.29 36.49,24.78 36.58,24.78 U$21.P$10
N$52
  Top 0.254: U$21.P$9 36.57,25.3 36.22,25.3 35.91,25 SDA5.1
N$53
  Top 0.254: R_REF_11.2 42.24,28 U$23.V+
N$54
  Top 0.254: R6.2 43.38,22.5 U$23.C-
N$55
  Top 0.254: U$23.V- 41,20 39.5,21.5 39.5,23.5 38.79,24.21 U$21.P$4
N$56
  Top 0.2: 41.86,25 42.94,25
  Top 0.254: PULSED_POWER5.1 34,28 39.5,28 40.5,27 40.5,26.75 41.25,26 41.25,25.25 41.5,25 41.86,25 | U$23.C+ 44.5,25 42.94,25
N$57
  Top 0.254: U$21.P$5 38.44,24.92 38.53,24.92 38.6,25 U$22.P$1
N$58
  Top 0.254: U$24.2 U$21.P$1
N$59
  Top 0.254: U$22.P$3 42.4,24.14 R_REF_12.2
N$60
  Top 0.254: U$22.P$2 42.4,25.84 R_REF_11.1
N$61
  Top 0.254: SCL6.1 35,35 36,36 36,36.28 36.49,36.78 36.58,36.78 U$25.P$10
N$62
  Top 0.254: U$25.P$9 36.57,37.3 36.22,37.3 35.91,37 SDA6.1
N$63
  Top 0.254: R_REF_13.2 42.24,40 U$27.V+
N$64
  Top 0.254: R7.2 43.38,34.5 U$27.C-
N$65
  Top 0.254: U$27.V- 41,32 39.5,33.5 39.5,35.5 38.79,36.21 U$25.P$4
N$66
  Top 0.2: 41.86,37 42.94,37
  Top 0.254: PULSED_POWER6.1 34,40 39.5,40 40.5,39 40.5,38.75 41.25,38 41.25,37.25 41.5,37 41.86,37 | U$27.C+ 44.5,37 42.94,37
N$67
  Top 0.254: U$25.P$5 38.44,36.92 38.53,36.92 38.6,37 U$26.P$1
N$68
  Top 0.254: U$28.2 U$25.P$1
N$69
  Top 0.254: U$26.P$3 42.4,36.15 R_REF_14.2
N$70
  Top 0.254: U$26.P$2 42.4,37.84 R_REF_13.1
N$81
  Top 0.254: SCL8.1 18,37 17,36 17,35.72 16.51,35.22 16.42,35.22 U$33.P$10
N$82
  Top 0.254: U$33.P$9 16.43,34.7 16.78,34.7 17.09,35 SDA8.1
N$83
  Top 0.254: R_REF_17.2 10.76,32 U$35.V+
N$84
  Top 0.254: R9.2 9.62,37.5 U$35.C-
N$85
  Top 0.254: U$35.V- 12,40 13.5,38.5 13.5,36.5 14.21,35.79 U$33.P$4
N$86
  Top 0.2: 11.14,35 10.06,35
  Top 0.254: PULSED_POWER8.1 19,32 13.5,32 12.5,33 12.5,33.25 11.75,34 11.75,34.75 11.5,35 11.14,35 | U$35.C+ 8.5,35 10.06,35
N$87
  Top 0.254: U$33.P$5 14.56,35.08 14.47,35.08 14.39,35 U$34.P$1
N$88
  Top 0.254: U$36.2 U$33.P$1
N$89
  Top 0.254: U$34.P$3 10.6,35.85 R_REF_18.2
N$90
  Top 0.254: U$34.P$2 10.6,34.16 R_REF_17.1
N$101
  Top 0.254: SCL10.1 35,47 36,48 36,48.28 36.49,48.78 36.58,48.78 U$41.P$10
N$102
  Top 0.254: U$41.P$9 36.57,49.3 36.22,49.3 35.91,49 SDA10.1
N$103
  Top 0.254: R_REF_21.2 42.24,52 U$43.V+
N$104
  Top 0.254: R11.2 43.38,46.5 U$43.C-
N$105
  Top 0.254: U$43.V- 41,44 39.5,45.5 39.5,47.5 38.79,48.21 U$41.P$4
N$106
  Top 0.2: 41.86,49 42.94,49
  Top 0.254: PULSED_POWER10.1 34,52 39.5,52 40.5,51 40.5,50.75 41.25,50 41.25,49.25 41.5,49 41.86,49 | U$43.C+ 44.5,49 42.94,49
N$107
  Top 0.254: U$41.P$5 38.44,48.92 38.53,48.92 38.6,49 U$42.P$1
N$108
  Top 0.254: U$44.2 U$41.P$1
N$109
  Top 0.254: U$42.P$3 42.4,48.15 R_REF_22.2
N$110
  Top 0.254: U$42.P$2 42.4,49.84 R_REF_21.1
N$121
  Top 0.254: SCL12.1 18,49 17,48 17,47.72 16.51,47.22 16.42,47.22 U$49.P$10
N$122
  Top 0.254: U$49.P$9 16.43,46.7 16.78,46.7 17.09,47 SDA12.1
N$123
  Top 0.254: R_REF_25.2 10.76,44 U$51.V+
N$124
  Top 0.254: R13.2 9.62,49.5 U$51.C-
N$125
  Top 0.254: U$51.V- 12,52 13.5,50.5 13.5,48.5 14.21,47.79 U$49.P$4
N$126
  Top 0.2: 11.14,47 10.06,47
  Top 0.254: PULSED_POWER12.1 19,44 13.5,44 12.5,45 12.5,45.25 11.75,46 11.75,46.75 11.5,47 11.14,47 | U$51.C+ 8.5,47 10.06,47
N$127
  Top 0.254: U$49.P$5 14.56,47.08 14.47,47.08 14.39,47 U$50.P$1
N$128
  Top 0.254: U$52.2 U$49.P$1
N$129
  Top 0.254: U$50.P$3 10.6,47.85 R_REF_26.2
N$130
  Top 0.254: U$50.P$2 10.6,46.16 R_REF_25.1
VDD  (7 unrouted)
  Top 0.254: 35,10 34,10 VDD.1 32.73,9 31.22,10.51 31.22,13.2 31.76,13.72 35.97,13.72 36.38,14.12 37.31,14.12 37.31,13.54 U$1.P$8 | C1.1 38.54,9.04 37.75,8.25 36.75,8.25 35,10 | U$5.3 35,10 | 18,14 19,14 VDD3.1 20.27,15 21.78,13.49 21.78,10.8 21.24,10.28 17.03,10.28 16.62,9.88 15.69,9.88 15.69,10.46 U$13.P$8 | C4.1 14.46,14.96 15.25,15.75 16.25,15.75 18,14 | U$16.3 18,14 | 35,22 34,22 VDD5.1 32.73,21 31.22,22.51 31.22,25.2 31.76,25.72 35.97,25.72 36.38,26.12 37.31,26.12 37.31,25.54 U$21.P$8 | C6.1 38.54,21.04 37.75,20.25 36.75,20.25 35,22 | U$24.3 35,22 | 18,26 19,26 VDD2.1 20.27,27 21.78,25.49 21.78,22.8 21.24,22.28 17.03,22.28 16.62,21.88 15.69,21.88 15.69,22.46 U$9.P$8 | C3.1 14.46,26.96 15.25,27.75 16.25,27.75 18,26 | U$12.3 18,26 | 35,34 34,34 VDD6.1 32.73,33 31.22,34.51 31.22,37.2 31.76,37.72 35.97,37.72 36.38,38.12 37.31,38.12 37.31,37.54 U$25.P$8 | C7.1 38.54,33.04 37.75,32.25 36.75,32.25 35,34 | U$28.3 35,34 | 18,38 19,38 VDD8.1 20.27,39 21.78,37.49 21.78,34.8 21.24,34.28 17.03,34.28 16.62,33.88 15.69,33.88 15.69,34.46 U$33.P$8 | C9.1 14.46,38.96 15.25,39.75 16.25,39.75 18,38 | U$36.3 18,38 | 35,46 34,46 VDD10.1 32.73,45 31.22,46.51 31.22,49.2 31.76,49.72 35.97,49.72 36.38,50.12 37.31,50.12 37.31,49.54 U$41.P$8 | C11.1 38.54,45.04 37.75,44.25 36.75,44.25 35,46 | U$44.3 35,46 | 18,50 19,50 VDD12.1 20.27,51 21.78,49.49 21.78,46.8 21.24,46.28 17.03,46.28 16.62,45.88 15.69,45.88 15.69,46.46 U$49.P$8 | C13.1 14.46,50.96 15.25,51.75 16.25,51.75 18,50 | U$52.3 18,50

### Text on the board
tNames: THMS Sensor Board v2 | ■ ADS1115 / ■ ADS1105 | ■ ADS1115 / ■ ADS1105 | THMS Sensor Board v2 | THMS Sensor Board v2 | ■ ADS1115 / ■ ADS1105 | ■ ADS1115 / ■ ADS1105 | THMS Sensor Board v2 | THMS Sensor Board v2 | ■ ADS1115 / ■ ADS1105 | ■ ADS1115 / ■ ADS1105 | THMS Sensor Board v2 | THMS Sensor Board v2 | ■ ADS1115 / ■ ADS1105 | ■ ADS1115 / ■ ADS1105 | THMS Sensor Board v2
bNames: S# | S# | S# | S# | S# | S# | S# | S#